# Altium schematic sheet Bluetooth interface - RN42.SchDoc: Bluetooth over UART
size A4; Organization: Altium Limited; Address1: 3 Minna Close; Address2: Belrose; Address3: NSW 2085; Address4: Australia
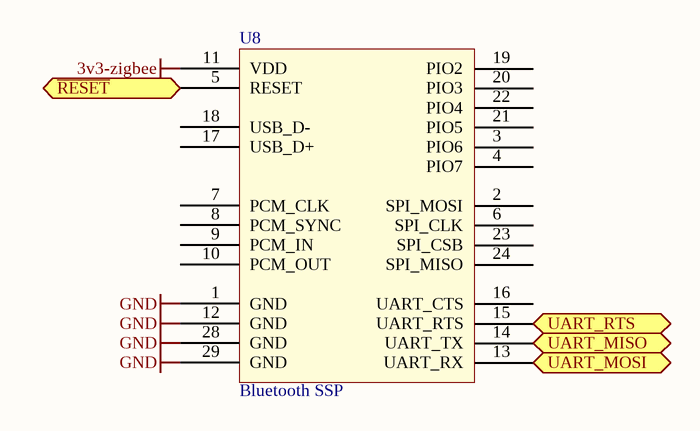
[diagram p0: Bluetooth interface - RN42.SchDoc]

## Parts
U8  Bluetooth SSP  [BlueTooth_RN4x]

## Ports
UART_MISO (out), UART_MOSI (in), UART_RTS (out), ~{RESET}

## Nets
3v3-zigbee: U8.11(VDD)
GND: U8.1(GND) U8.12(GND) U8.28(GND) U8.29(GND)
~{RESET}: U8.5(RESET) ; port ~{RESET}
UART_MISO: U8.14(UART_TX) ; port UART_MISO
UART_MOSI: U8.13(UART_RX) ; port UART_MOSI
UART_RTS: U8.15(UART_RTS) ; port UART_RTS

Not connected (* = marked no-connect by the designer): U8 2(SPI_MOSI) 3(PIO6) 4(PIO7) 6(SPI_CLK) 7(PCM_CLK) 8(PCM_SYNC) 9(PCM_IN) 10(PCM_OUT) 16(UART_CTS) 17(USB_D+) 18(USB_D-) 19(PIO2) 20(PIO3) 21(PIO5) 22(PIO4) 23(SPI_CSB) 24(SPI_MISO)

## Notes on the sheet
- Disclaimer
  Any design and information, hardware or software  is provided on an "as-is" basis without warranty of any kind and any express or implied warranties, including, but not limited to, the implied warranties of merchantability and fitness for a particular purpose are disclaimed. In no event shall wnpd (or KeaDrone)be liable for any direct, indirect, incidental, special, exemplary, or consequential damages (including, but not limited to, procurement of substitute goods or services; loss of use, data, or profits; or business interruption) however caused and on any theory of liability, whether in contract, strict liability, or tort (including negligence or otherwise) arising in any way out of the use of this firmware, hardware, software or information, even if wnpd (or KeaDrone) has been advised by user of the possibility of such potential loss or damage. The user agrees to hold wnpd (or KeaDrone) harmless from and against any and all claims, losses, liabilities and expenses.
- Title
- Size:
- Date:
- A4
- Name:
- Time:
- Ing. W. Pietersz
- Revision:
- Sheet
- of
- WillyPietersz@gmail.com
- Contact:
- -
- www.wnpd.nl
- File:

## Library data of the parts
U8 = BlueTooth-RN42: Wireless, Bluetooth; Part Number: BlueTooth-RN42; Component Type: Wireless, Bluetooth; ComponentLink1Description: Datasheet; ComponentLink1URL: http://www.sparkfun.com/datasheets/Wireless/Bluetooth/rn-42-ds.pdf